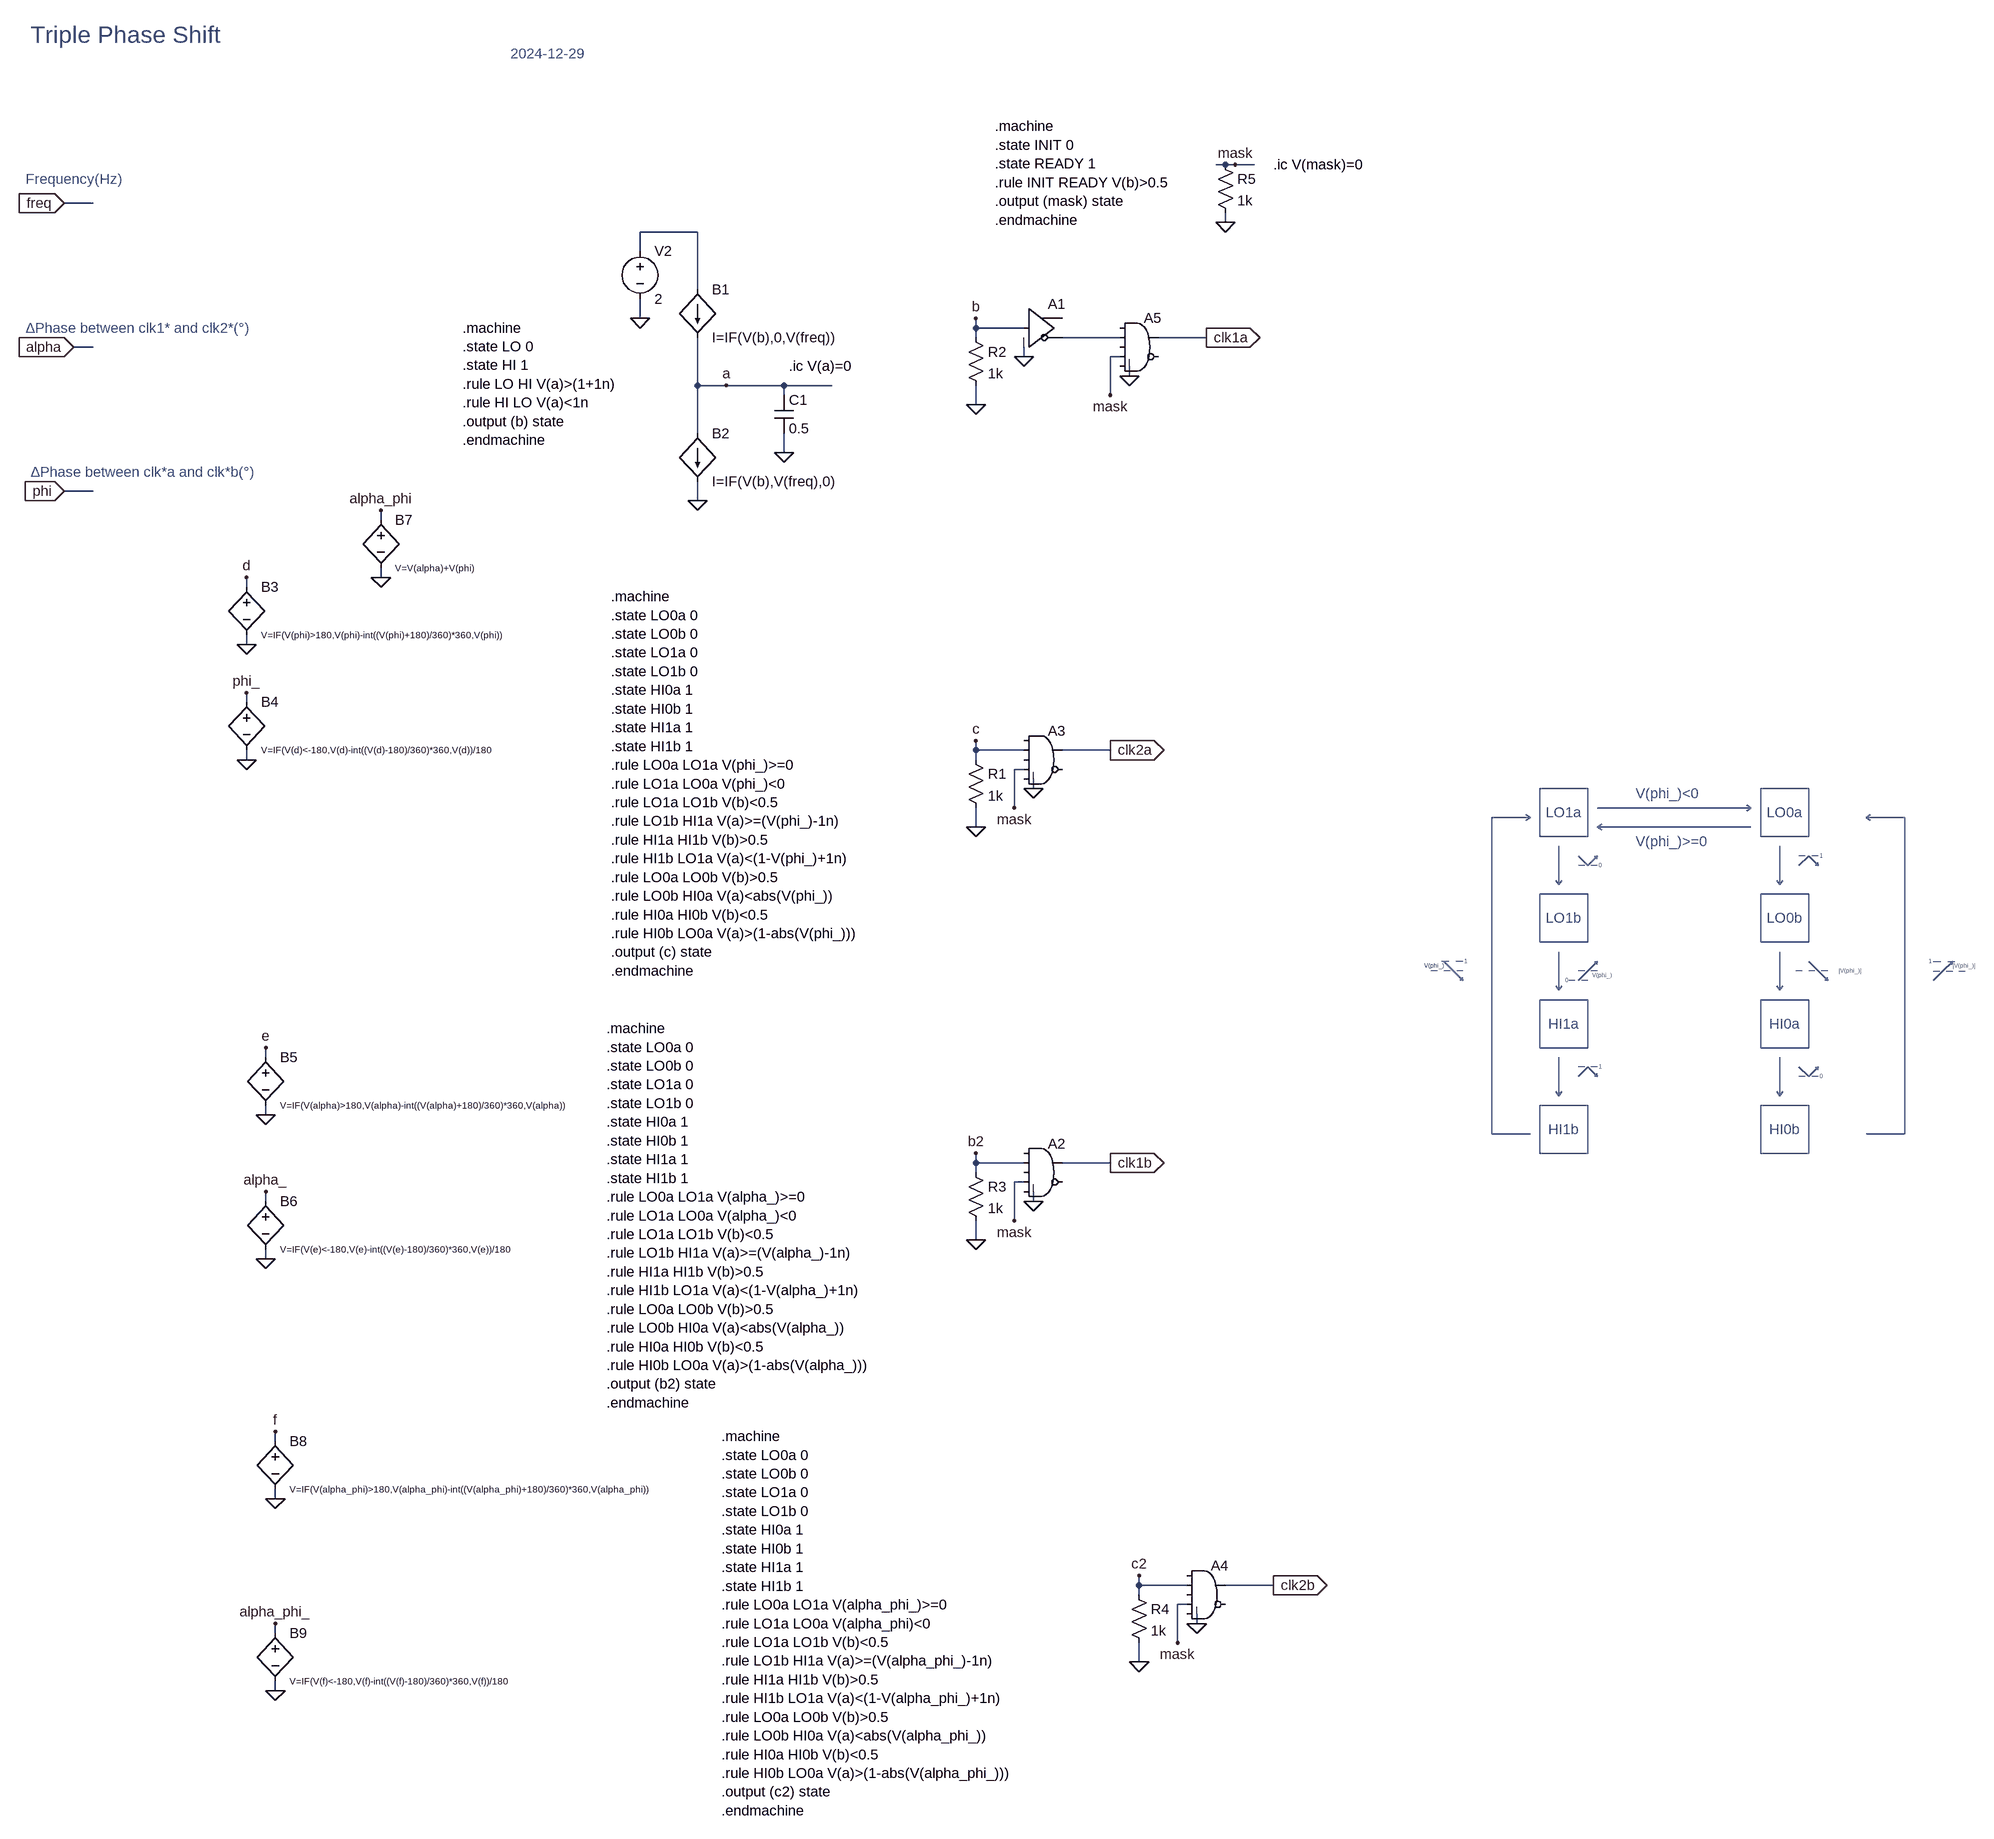
[diagram p0: schematic PHASESHIFT3.asc]
PHASESHIFT3.asc, the LTspice schematic file:
Version 4
SHEET 1 2476 2456
WIRE 752 -240 736 -240
WIRE 768 -240 752 -240
WIRE 800 -240 768 -240
WIRE -1136 -176 -1184 -176
WIRE 752 -144 752 -160
WIRE -128 -128 -224 -128
WIRE -224 -96 -224 -128
WIRE -128 -32 -128 -128
WIRE -224 16 -224 -16
WIRE 336 32 336 16
WIRE 416 32 336 32
WIRE 336 48 336 32
WIRE 576 48 480 48
WIRE 720 48 640 48
WIRE -1136 64 -1168 64
WIRE 416 80 416 64
WIRE 576 80 560 80
WIRE 592 112 592 96
WIRE -128 128 -128 48
WIRE -80 128 -128 128
WIRE 16 128 -80 128
WIRE 96 128 16 128
WIRE 16 144 16 128
WIRE 560 144 560 80
WIRE 336 160 336 128
WIRE -128 208 -128 128
WIRE 16 240 16 208
WIRE -1136 304 -1184 304
WIRE -128 320 -128 288
WIRE -656 352 -656 336
WIRE -656 448 -656 432
WIRE -880 464 -880 448
WIRE -880 560 -880 544
WIRE -880 656 -880 640
WIRE 336 736 336 720
WIRE 416 736 336 736
WIRE 560 736 480 736
WIRE -880 752 -880 736
WIRE 336 752 336 736
WIRE 416 768 400 768
WIRE 432 800 432 784
WIRE 400 832 400 768
WIRE 336 864 336 832
WIRE -848 1248 -848 1232
WIRE -848 1344 -848 1328
WIRE 336 1424 336 1408
WIRE 416 1424 336 1424
WIRE 560 1424 480 1424
WIRE 336 1440 336 1424
WIRE 416 1456 400 1456
WIRE -848 1488 -848 1472
WIRE 432 1488 432 1472
WIRE 400 1520 400 1456
WIRE 336 1552 336 1520
WIRE -848 1584 -848 1568
WIRE -832 1888 -832 1872
WIRE -832 1984 -832 1968
WIRE 608 2128 608 2112
WIRE 688 2128 608 2128
WIRE 832 2128 752 2128
WIRE 608 2144 608 2128
WIRE 688 2160 672 2160
WIRE 704 2192 704 2176
WIRE -832 2208 -832 2192
WIRE 672 2224 672 2160
WIRE 608 2256 608 2224
WIRE -832 2304 -832 2288
FLAG -1184 -176 freq
IOPIN -1184 -176 In
FLAG 16 240 0
FLAG -224 16 0
FLAG -1168 64 alpha
IOPIN -1168 64 In
FLAG -128 320 0
FLAG 336 160 0
FLAG -80 128 a
FLAG -880 560 0
FLAG -880 448 d
FLAG 720 48 clk1a
IOPIN 720 48 Out
FLAG 336 16 b
FLAG 336 864 0
FLAG 560 736 clk2a
IOPIN 560 736 Out
FLAG 336 720 c
FLAG -880 752 0
FLAG -880 640 phi_
FLAG 336 1552 0
FLAG 560 1424 clk1b
IOPIN 560 1424 Out
FLAG 336 1408 b2
FLAG 608 2256 0
FLAG 832 2128 clk2b
IOPIN 832 2128 Out
FLAG 608 2112 c2
FLAG -1184 304 phi
IOPIN -1184 304 In
FLAG -848 1344 0
FLAG -848 1232 e
FLAG -848 1584 0
FLAG -848 1472 alpha_
FLAG -656 448 0
FLAG -656 336 alpha_phi
FLAG -832 1984 0
FLAG -832 1872 f
FLAG -832 2304 0
FLAG -832 2192 alpha_phi_
FLAG 416 80 0
FLAG 592 112 0
FLAG 560 144 mask
FLAG 432 800 0
FLAG 400 832 mask
FLAG 432 1488 0
FLAG 400 1520 mask
FLAG 704 2192 0
FLAG 672 2224 mask
FLAG 752 -144 0
FLAG 768 -240 mask
SYMBOL cap 0 144 R0
SYMATTR InstName C1
SYMATTR Value 0.5
SYMBOL voltage -224 -112 R0
WINDOW 123 0 0 Left 0
WINDOW 39 0 0 Left 0
SYMATTR InstName V2
SYMATTR Value 2
SYMBOL bi -128 -32 R0
SYMATTR InstName B1
SYMATTR Value I=IF(V(b),0,V(freq))
SYMBOL bi -128 208 R0
SYMATTR InstName B2
SYMATTR Value I=IF(V(b),V(freq),0)
SYMBOL res 320 32 R0
SYMATTR InstName R2
SYMATTR Value 1k
SYMBOL bv -880 448 R0
WINDOW 3 24 96 Left 1
SYMATTR Value V=IF(V(phi)>180,V(phi)-int((V(phi)+180)/360)*360,V(phi))
SYMATTR InstName B3
SYMBOL Digital\\buf 416 -32 R0
SYMATTR InstName A1
SYMBOL res 320 736 R0
SYMATTR InstName R1
SYMATTR Value 1k
SYMBOL bv -880 640 R0
WINDOW 3 24 96 Left 1
SYMATTR Value V=IF(V(d)<-180,V(d)-int((V(d)-180)/360)*360,V(d))/180
SYMATTR InstName B4
SYMBOL res 320 1424 R0
SYMATTR InstName R3
SYMATTR Value 1k
SYMBOL res 592 2128 R0
SYMATTR InstName R4
SYMATTR Value 1k
SYMBOL bv -848 1232 R0
WINDOW 3 24 96 Left 1
SYMATTR Value V=IF(V(alpha)>180,V(alpha)-int((V(alpha)+180)/360)*360,V(alpha))
SYMATTR InstName B5
SYMBOL bv -848 1472 R0
WINDOW 3 24 96 Left 1
SYMATTR Value V=IF(V(e)<-180,V(e)-int((V(e)-180)/360)*360,V(e))/180
SYMATTR InstName B6
SYMBOL bv -656 336 R0
WINDOW 3 24 96 Left 1
SYMATTR Value V=V(alpha)+V(phi)
SYMATTR InstName B7
SYMBOL bv -832 1872 R0
WINDOW 3 24 96 Left 1
SYMATTR Value V=IF(V(alpha_phi)>180,V(alpha_phi)-int((V(alpha_phi)+180)/360)*360,V(alpha_phi))
SYMATTR InstName B8
SYMBOL bv -832 2192 R0
WINDOW 3 24 96 Left 1
SYMATTR Value V=IF(V(f)<-180,V(f)-int((V(f)-180)/360)*360,V(f))/180
SYMATTR InstName B9
SYMBOL Digital\\and 608 0 R0
SYMATTR InstName A5
SYMBOL Digital\\and 448 688 R0
SYMATTR InstName A3
SYMBOL Digital\\and 448 1376 R0
SYMATTR InstName A2
SYMBOL Digital\\and 720 2080 R0
SYMATTR InstName A4
SYMBOL res 736 -256 R0
SYMATTR InstName R5
SYMATTR Value 1k
TEXT -520 32 Left 2 !.machine\n.state LO 0\n.state HI 1\n.rule LO HI V(a)>(1+1n)\n.rule HI LO V(a)<1n\n.output (b) state\n.endmachine
TEXT 24 96 Left 2 !.ic V(a)=0
TEXT -272 480 Left 2 !.machine\n.state LO0a 0\n.state LO0b 0\n.state LO1a 0\n.state LO1b 0\n.state HI0a 1\n.state HI0b 1\n.state HI1a 1\n.state HI1b 1\n.rule LO0a LO1a V(phi_)>=0\n.rule LO1a LO0a V(phi_)<0\n.rule LO1a LO1b V(b)<0.5\n.rule LO1b HI1a V(a)>=(V(phi_)-1n)\n.rule HI1a HI1b V(b)>0.5\n.rule HI1b LO1a V(a)<(1-V(phi_)+1n)\n.rule LO0a LO0b V(b)>0.5\n.rule LO0b HI0a V(a)<abs(V(phi_))\n.rule HI0a HI0b V(b)<0.5\n.rule HI0b LO0a V(a)>(1-abs(V(phi_)))\n.output (c) state\n.endmachine
TEXT 832 -240 Left 2 !.ic V(mask)=0
TEXT -280 1200 Left 2 !.machine\n.state LO0a 0\n.state LO0b 0\n.state LO1a 0\n.state LO1b 0\n.state HI0a 1\n.state HI0b 1\n.state HI1a 1\n.state HI1b 1\n.rule LO0a LO1a V(alpha_)>=0\n.rule LO1a LO0a V(alpha_)<0\n.rule LO1a LO1b V(b)<0.5\n.rule LO1b HI1a V(a)>=(V(alpha_)-1n)\n.rule HI1a HI1b V(b)>0.5\n.rule HI1b LO1a V(a)<(1-V(alpha_)+1n)\n.rule LO0a LO0b V(b)>0.5\n.rule LO0b HI0a V(a)<abs(V(alpha_))\n.rule HI0a HI0b V(b)<0.5\n.rule HI0b LO0a V(a)>(1-abs(V(alpha_)))\n.output (b2) state\n.endmachine
TEXT -88 1880 Left 2 !.machine\n.state LO0a 0\n.state LO0b 0\n.state LO1a 0\n.state LO1b 0\n.state HI0a 1\n.state HI0b 1\n.state HI1a 1\n.state HI1b 1\n.rule LO0a LO1a V(alpha_phi_)>=0\n.rule LO1a LO0a V(alpha_phi)<0\n.rule LO1a LO1b V(b)<0.5\n.rule LO1b HI1a V(a)>=(V(alpha_phi_)-1n)\n.rule HI1a HI1b V(b)>0.5\n.rule HI1b LO1a V(a)<(1-V(alpha_phi_)+1n)\n.rule LO0a LO0b V(b)>0.5\n.rule LO0b HI0a V(a)<abs(V(alpha_phi_))\n.rule HI0a HI0b V(b)<0.5\n.rule HI0b LO0a V(a)>(1-abs(V(alpha_phi_)))\n.output (c2) state\n.endmachine
TEXT 368 -304 Left 2 !.machine\n.state INIT 0\n.state READY 1\n.rule INIT READY V(b)>0.5\n.output (mask) state\n.endmachine
TEXT 1416 840 Center 2 ;LO1a
TEXT 1784 840 Center 2 ;LO0a
TEXT 1536 808 Left 2 ;V(phi_)<0
TEXT 1656 888 Right 2 ;V(phi_)>=0
TEXT 1480 928 Right 0 ;0
TEXT 1416 1016 Center 2 ;LO1b
TEXT 1496 1112 Right 0 ;V(phi_)
TEXT 1424 1120 Right 0 ;0
TEXT 1416 1192 Center 2 ;HI1a
TEXT 1480 1264 Right 0 ;1
TEXT 1416 1368 Center 2 ;HI1b
TEXT 1256 1088 Right 0 ;1
TEXT 1216 1096 Right 0 ;V(phi_)
TEXT 1784 1016 Center 2 ;LO0b
TEXT 1784 1192 Center 2 ;HI0a
TEXT 1784 1368 Center 2 ;HI0b
TEXT 1848 912 Right 0 ;1
TEXT 1216 1096 Right 0 ;V(phi_)
TEXT 1912 1104 Right 0 ;|V(phi_)|
TEXT 1848 1280 Right 0 ;0
TEXT 2024 1088 Left 0 ;1
TEXT 2064 1096 Left 0 ;|V(phi_)|
TEXT -1240 -480 Left 4 ;Triple Phase Shift
TEXT -1248 -216 Left 2 ;Frequency(Hz)
TEXT -1248 32 Left 2 ;ΔPhase between clk1* and clk2*(°)
TEXT -1240 272 Left 2 ;ΔPhase between clk*a and clk*b(°)
TEXT -440 -448 Left 2 ;2024-12-29
LINE Normal 1728 832 1472 832
LINE Normal 1728 832 1728 832 2
LINE Normal 1721 837 1728 832
LINE Normal 1728 832 1721 827
LINE Normal 1472 864 1728 864
LINE Normal 1472 864 1472 864 2
LINE Normal 1479 869 1472 864
LINE Normal 1472 864 1479 859
LINE Normal 1408 960 1408 896
LINE Normal 1408 960 1408 960 2
LINE Normal 1413 953 1408 960
LINE Normal 1408 960 1403 953
LINE Normal 1456 928 1440 912
LINE Normal 1472 912 1456 928
LINE Normal 1472 928 1440 928 2
LINE Normal 1471 917 1472 912
LINE Normal 1467 913 1472 912
LINE Normal 1408 1136 1408 1072
LINE Normal 1408 1136 1408 1136 2
LINE Normal 1413 1129 1408 1136
LINE Normal 1408 1136 1403 1129
LINE Normal 1472 1088 1456 1104
LINE Normal 1472 1104 1440 1104 2
LINE Normal 1471 1093 1472 1088
LINE Normal 1467 1089 1472 1088
LINE Normal 1456 1104 1440 1120
LINE Normal 1456 1120 1424 1120 2
LINE Normal 1408 1136 1408 1136 2
LINE Normal 1408 1312 1408 1248
LINE Normal 1408 1312 1408 1312 2
LINE Normal 1413 1305 1408 1312
LINE Normal 1408 1312 1403 1305
LINE Normal 1456 1264 1440 1280
LINE Normal 1472 1280 1456 1264
LINE Normal 1472 1264 1440 1264 2
LINE Normal 1471 1275 1472 1280
LINE Normal 1467 1279 1472 1280
LINE Normal 1360 848 1296 848
LINE Normal 1360 848 1360 848 2
LINE Normal 1353 843 1360 848
LINE Normal 1360 848 1353 853
LINE Normal 1296 1376 1296 848
LINE Normal 1296 1376 1360 1376
LINE Normal 1232 1104 1216 1088
LINE Normal 1248 1120 1232 1104
LINE Normal 1248 1104 1184 1104 2
LINE Normal 1247 1115 1248 1120
LINE Normal 1243 1119 1248 1120
LINE Normal 1248 1088 1200 1088 2
LINE Normal 1776 960 1776 896
LINE Normal 1776 960 1776 960 2
LINE Normal 1781 953 1776 960
LINE Normal 1776 960 1771 953
LINE Normal 1776 1136 1776 1072
LINE Normal 1776 1136 1776 1136 2
LINE Normal 1781 1129 1776 1136
LINE Normal 1776 1136 1771 1129
LINE Normal 1776 1136 1776 1136 2
LINE Normal 1776 1312 1776 1248
LINE Normal 1776 1312 1776 1312 2
LINE Normal 1781 1305 1776 1312
LINE Normal 1776 1312 1771 1305
LINE Normal 1824 912 1808 928
LINE Normal 1840 928 1824 912
LINE Normal 1840 912 1808 912 2
LINE Normal 1839 923 1840 928
LINE Normal 1835 927 1840 928
LINE Normal 1232 1104 1216 1088
LINE Normal 1248 1120 1232 1104
LINE Normal 1248 1104 1184 1104 2
LINE Normal 1247 1115 1248 1120
LINE Normal 1243 1119 1248 1120
LINE Normal 1248 1088 1200 1088 2
LINE Normal 1840 1104 1824 1088
LINE Normal 1856 1120 1840 1104
LINE Normal 1856 1104 1792 1104 2
LINE Normal 1855 1115 1856 1120
LINE Normal 1851 1119 1856 1120
LINE Normal 1840 1104 1824 1088
LINE Normal 1856 1120 1840 1104
LINE Normal 1856 1104 1792 1104 2
LINE Normal 1855 1115 1856 1120
LINE Normal 1851 1119 1856 1120
LINE Normal 1824 1280 1808 1264
LINE Normal 1840 1264 1824 1280
LINE Normal 1840 1280 1808 1280 2
LINE Normal 1839 1269 1840 1264
LINE Normal 1835 1265 1840 1264
LINE Normal 1920 848 1984 848
LINE Normal 1920 848 1920 848 2
LINE Normal 1927 843 1920 848
LINE Normal 1920 848 1927 853
LINE Normal 1984 1376 1984 848
LINE Normal 1984 1376 1920 1376
LINE Normal 2048 1104 2064 1088
LINE Normal 2032 1120 2048 1104
LINE Normal 2032 1104 2096 1104 2
LINE Normal 2063 1093 2064 1088
LINE Normal 2059 1089 2064 1088
LINE Normal 2032 1088 2080 1088 2
LINE Normal 2048 1104 2064 1088
LINE Normal 2032 1120 2048 1104
LINE Normal 2032 1104 2096 1104 2
LINE Normal 2063 1093 2064 1088
LINE Normal 2059 1089 2064 1088
LINE Normal 2032 1088 2080 1088 2
RECTANGLE Normal 1456 880 1376 800
RECTANGLE Normal 1824 880 1744 800
RECTANGLE Normal 1456 1056 1376 976
RECTANGLE Normal 1456 1232 1376 1152
RECTANGLE Normal 1456 1408 1376 1328
RECTANGLE Normal 1824 1056 1744 976
RECTANGLE Normal 1824 1232 1744 1152
RECTANGLE Normal 1824 1408 1744 1328

The netlist it stands for:
* PHASESHIFT3.asc
C1 a 0 0.5
V2 N001 0 2
B1 N001 a I=IF(V(b),0,V(freq))
B2 a 0 I=IF(V(b),V(freq),0)
R2 b 0 1k
B3 d 0 V=IF(V(phi)>180,V(phi)-int((V(phi)+180)/360)*360,V(phi))
A1 b 0 0 0 0 N002 0 0 BUF
R1 c 0 1k
B4 phi_ 0 V=IF(V(d)<-180,V(d)-int((V(d)-180)/360)*360,V(d))/180
R3 b2 0 1k
R4 c2 0 1k
B5 e 0 V=IF(V(alpha)>180,V(alpha)-int((V(alpha)+180)/360)*360,V(alpha))
B6 alpha_ 0 V=IF(V(e)<-180,V(e)-int((V(e)-180)/360)*360,V(e))/180
B7 alpha_phi 0 V=V(alpha)+V(phi)
B8 f 0 V=IF(V(alpha_phi)>180,V(alpha_phi)-int((V(alpha_phi)+180)/360)*360,V(alpha_phi))
B9 alpha_phi_ 0 V=IF(V(f)<-180,V(f)-int((V(f)-180)/360)*360,V(f))/180
A5 0 N002 0 mask 0 0 clk1a 0 AND
A3 0 c 0 mask 0 0 clk2a 0 AND
A2 0 b2 0 mask 0 0 clk1b 0 AND
A4 0 c2 0 mask 0 0 clk2b 0 AND
R5 mask 0 1k
.machine
.state LO 0
.state HI 1
.rule LO HI V(a)>(1+1n)
.rule HI LO V(a)<1n
.output (b) state
.endmachine
.ic V(a)=0
.machine
.state LO0a 0
.state LO0b 0
.state LO1a 0
.state LO1b 0
.state HI0a 1
.state HI0b 1
.state HI1a 1
.state HI1b 1
.rule LO0a LO1a V(phi_)>=0
.rule LO1a LO0a V(phi_)<0
.rule LO1a LO1b V(b)<0.5
.rule LO1b HI1a V(a)>=(V(phi_)-1n)
.rule HI1a HI1b V(b)>0.5
.rule HI1b LO1a V(a)<(1-V(phi_)+1n)
.rule LO0a LO0b V(b)>0.5
.rule LO0b HI0a V(a)<abs(V(phi_))
.rule HI0a HI0b V(b)<0.5
.rule HI0b LO0a V(a)>(1-abs(V(phi_)))
.output (c) state
.endmachine
.ic V(mask)=0
.machine
.state LO0a 0
.state LO0b 0
.state LO1a 0
.state LO1b 0
.state HI0a 1
.state HI0b 1
.state HI1a 1
.state HI1b 1
.rule LO0a LO1a V(alpha_)>=0
.rule LO1a LO0a V(alpha_)<0
.rule LO1a LO1b V(b)<0.5
.rule LO1b HI1a V(a)>=(V(alpha_)-1n)
.rule HI1a HI1b V(b)>0.5
.rule HI1b LO1a V(a)<(1-V(alpha_)+1n)
.rule LO0a LO0b V(b)>0.5
.rule LO0b HI0a V(a)<abs(V(alpha_))
.rule HI0a HI0b V(b)<0.5
.rule HI0b LO0a V(a)>(1-abs(V(alpha_)))
.output (b2) state
.endmachine
.machine
.state LO0a 0
.state LO0b 0
.state LO1a 0
.state LO1b 0
.state HI0a 1
.state HI0b 1
.state HI1a 1
.state HI1b 1
.rule LO0a LO1a V(alpha_phi_)>=0
.rule LO1a LO0a V(alpha_phi)<0
.rule LO1a LO1b V(b)<0.5
.rule LO1b HI1a V(a)>=(V(alpha_phi_)-1n)
.rule HI1a HI1b V(b)>0.5
.rule HI1b LO1a V(a)<(1-V(alpha_phi_)+1n)
.rule LO0a LO0b V(b)>0.5
.rule LO0b HI0a V(a)<abs(V(alpha_phi_))
.rule HI0a HI0b V(b)<0.5
.rule HI0b LO0a V(a)>(1-abs(V(alpha_phi_)))
.output (c2) state
.endmachine
.machine
.state INIT 0
.state READY 1
.rule INIT READY V(b)>0.5
.output (mask) state
.endmachine
* LO1a
* LO0a
* V(phi_)<0
* V(phi_)>=0
* 0
* LO1b
* V(phi_)
* 0
* HI1a
* 1
* HI1b
* 1
* V(phi_)
* LO0b
* HI0a
* HI0b
* 1
* V(phi_)
* |V(phi_)|
* 0
* 1
* |V(phi_)|
* Triple Phase Shift
* Frequency(Hz)
* ΔPhase between clk1* and clk2*(°)
* ΔPhase between clk*a and clk*b(°)
* 2024-12-29
.backanno
.end